# EasyEDA schematic 1-Schematic_INFRARED_WAVER_V0_CHEAP.json
TITLE: Sheet_1; REV: 1.0; Date: 2022-12-25; Sheet: 1/1; Drawn By: maarnotto; Company: Your Company
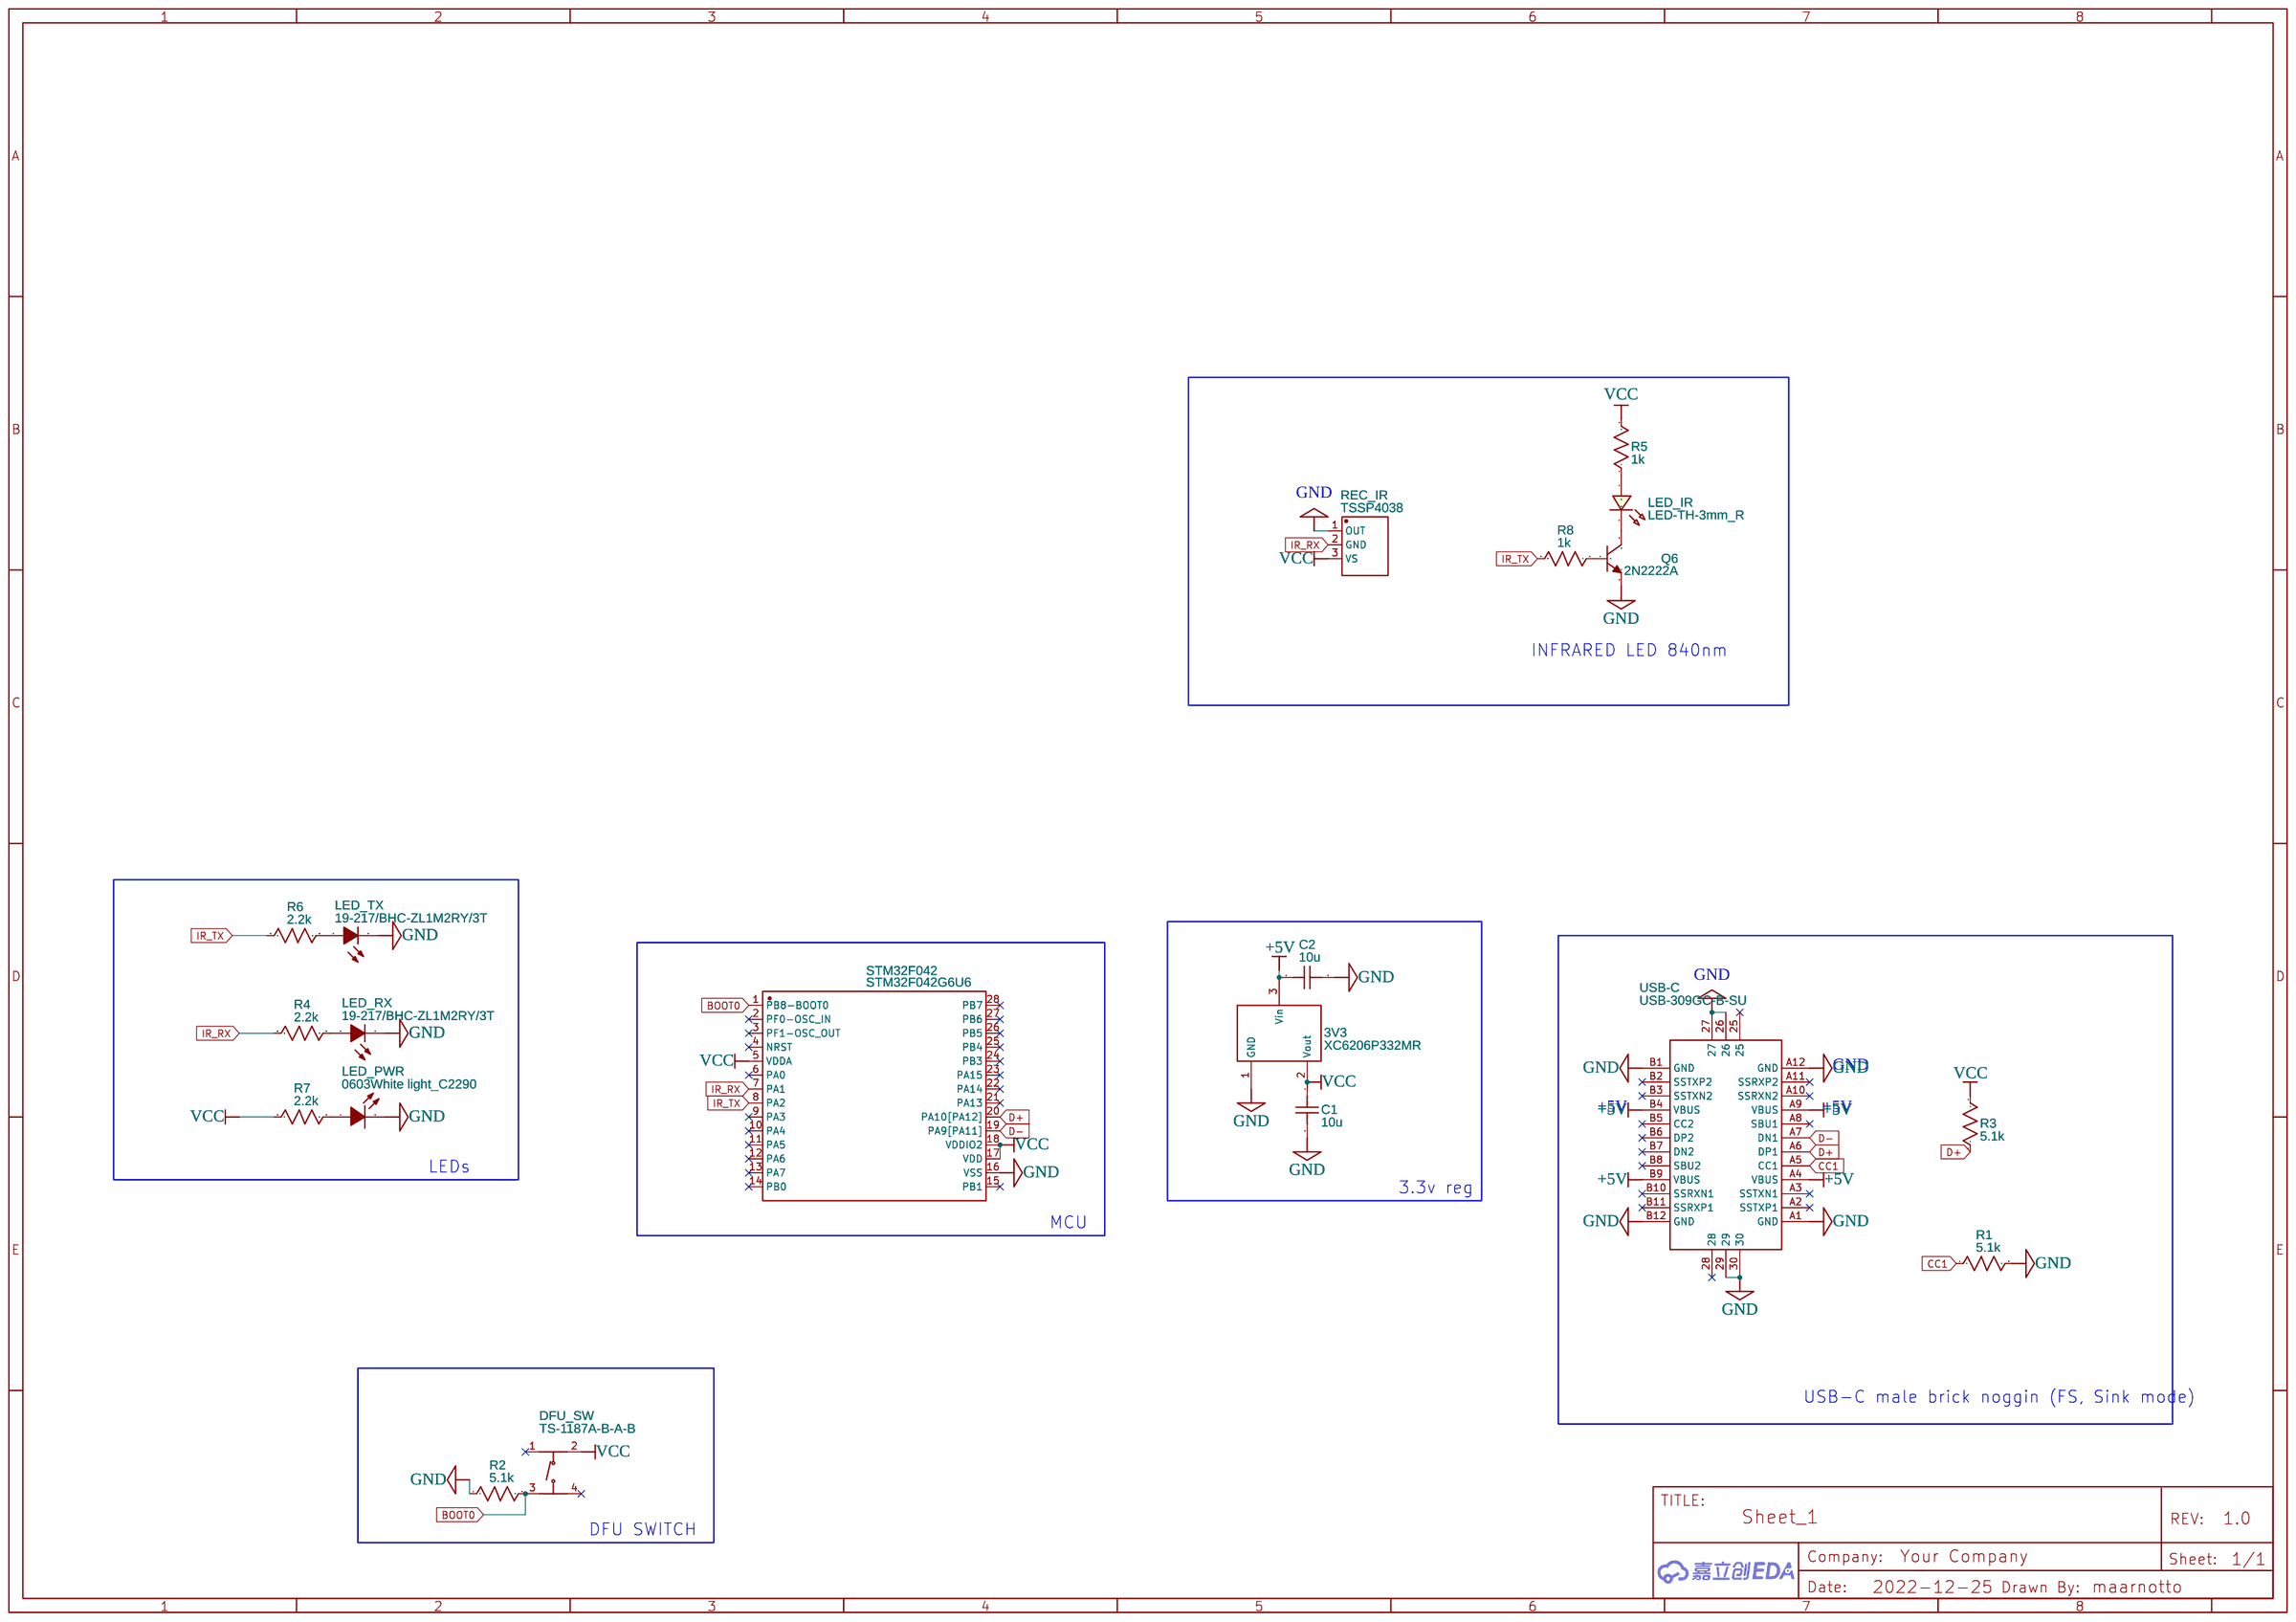
[diagram p0: schematic sheet]

## Parts
3V3  XC6206P332MR  [SOT-23-3_L2.9-W1.6-P1.90-LS2.8-BR]
C1  10u  [C0603]
C2  10u  [C0603]
DFU_SW  TS-1187A-B-A-B  [SW-SMD_4P-L5.1-W5.1-P3.70-LS6.5-TL-2]
LED_IR  LED-TH-3mm_R  [LED-TH_BD3.0_RED]
LED_PWR  0603White light_C2290  [LED0603-R-RD_WHITE]
LED_RX  19-217/BHC-ZL1M2RY/3T  [LED0603-RD]
LED_TX  19-217/BHC-ZL1M2RY/3T  [LED0603-RD]
Q6  2N2222A  [TO-92-3_L4.8-W3.7-P2.54-R]
R1  5.1k  [R0603]
R2  5.1k  [R0603]
R3  5.1k  [R0603]
R4  2.2k  [R0603]
R5  1k  [R_AXIAL-0.3]
R6  2.2k  [R0603]
R7  2.2k  [R0603]
R8  1k  [R_AXIAL-0.3]
REC_IR  TSSP4038  [SENSOR-TH_TSSP40X]
STM32F042  STM32F042G6U6  [UFQFPN-28_L4.0-W4.0-P0.50-BL]
USB-C  USB-309GC-B-SU  [USB-C-SMD_USB-309GC-B-SU]

## Library data of the parts
3V3 = XC6206P332MR: Supplier: LCSC; Manufacturer: TOREX(特瑞仕); Supplier Part: C5446; JLCPCB Part Class: Basic Part
C1 C2 = C_0603_US: Contributor: LCEDA_Lib
DFU_SW = TS-1187A-B-A-B: Supplier: LCSC; Supplier Part: C318884; Manufacturer: XKB Connectivity(中国星坤); Contributor: LCSC; JLCPCB Part Class: Basic Part
LED_IR = LED-TH-3mm_R: Manufacturer: EVERLIGHT(台湾亿光); Manufacturer Part: 204-10SDRD/S530-A3-L; Supplier Part: C84774; Supplier: LCSC; Contributor: LCEDA_Lib
LED_PWR = 0603White light_C2290: Supplier: LCSC; Manufacturer: null; Manufacturer Part: KT-0603白灯; Supplier Part: C2290; JLCPCB Part Class: Basic Part
LED_RX LED_TX = 19-217/BHC-ZL1M2RY/3T: Supplier: LCSC; Manufacturer: EVERLIGHT(亿光); Supplier Part: C72041; JLCPCB Part Class: Basic Part
Q6 = 2N2222A: Supplier: LCSC; Supplier Part: C358533; Manufacturer: BLUE ROCKET(蓝箭); Contributor: LCSC; JLCPCB Part Class: Extended Part
R1-R4 R6 R7 = R_0603_US: Contributor: LCEDA_Lib
R5 R8 = R_AXIAL-0.3_US: Contributor: LCEDA_Lib
REC_IR = TSSP4038: Contributor: LCSC; Supplier: LCSC; Manufacturer: VISHAY(威世); Supplier Part: C143753; JLCPCB Part Class: Extended Part
STM32F042 = STM32F042G6U6: Contributor: LCSC; Supplier: LCSC; Supplier Part: C961597; Manufacturer: ST(意法半导体); JLCPCB Part Class: Extended Part
USB-C = USB-309GC-B-SU: Contributor: LCSC; Supplier: LCSC; Supplier Part: C309336; Manufacturer: HOOYA; JLCPCB Part Class: Extended Part

## Nets
+5V: 3V3.3(Vin) C2.2 USB-C.A4(VBUS) USB-C.A9(VBUS) USB-C.B4(VBUS) USB-C.B9(VBUS)
GND: 3V3.1(GND) C1.2 C2.1 LED_PWR.2(K) LED_RX.1(C) LED_TX.1(C) Q6.3(E) R1.2 R2.1 REC_IR.1(OUT) STM32F042.16(VSS) USB-C.26 USB-C.27 USB-C.29 USB-C.30 USB-C.A1(GND) USB-C.A12(GND) USB-C.B1(GND) USB-C.B12(GND)
VCC: 3V3.2(Vout) C1.1 DFU_SW.2(B) R3.1 R5.2 R7.1 REC_IR.3(VS) STM32F042.5(VDDA) STM32F042.17(VDD) STM32F042.18(VDDIO2)
BOOT0: DFU_SW.3(C) R2.2 STM32F042.1(PB8-BOOT0)
CC1: R1.1 USB-C.A5(CC1)
D+: R3.2 STM32F042.20(PA10[PA12]) USB-C.A6(DP1)
D-: STM32F042.19(PA9[PA11]) USB-C.A7(DN1)
IR_RX: R4.1 REC_IR.2(GND) STM32F042.7(PA1)
IR_TX: R6.1 R8.2 STM32F042.8(PA2)
Net-(LED_IR-1): LED_IR.1 R5.1
Net-(LED_IR-2): LED_IR.2 Q6.1(C)
Net-(LED_PWR-1): LED_PWR.1(A) R7.2
Net-(LED_RX-2): LED_RX.2(A) R4.2
Net-(LED_TX-2): LED_TX.2(A) R6.2
Net-(Q6-2): Q6.2(B) R8.1

Not connected (* = marked no-connect by the designer): DFU_SW 1(A)* 4(D)*; STM32F042 2(PF0-OSC_IN)* 3(PF1-OSC_OUT)* 4(NRST)* 6(PA0)* 9(PA3)* 10(PA4)* 11(PA5)* 12(PA6)* 13(PA7)* 14(PB0)* 15(PB1)* 21(PA13)* 22(PA14)* 23(PA15)* 24(PB3)* 25(PB4)* 26(PB5)* 27(PB6)* 28(PB7)*; USB-C 25* 28* A2(SSTXP1)* A3(SSTXN1)* A8(SBU1)* A10(SSRXN2)* A11(SSRXP2)* B2(SSTXP2)* B3(SSTXN2)* B5(CC2)* B6(DP2)* B7(DN2)* B8(SBU2)* B10(SSRXN1)* B11(SSRXP1)*

## Notes on the sheet
- INFRARED LED 840nm
- GND
- +5V
- +5V
- LEDs
- 3.3v reg
- MCU
- USB-C male brick noggin (FS, Sink mode)
- DFU SWITCH
